# Altium schematic sheet ADC_8CH.SchDoc: =DocumentName
size A3; DocumentNumber: 1; Revision: 0; SheetNumber: 13; SheetTotal: 15; Last modified by: Krzysztof Belewicz
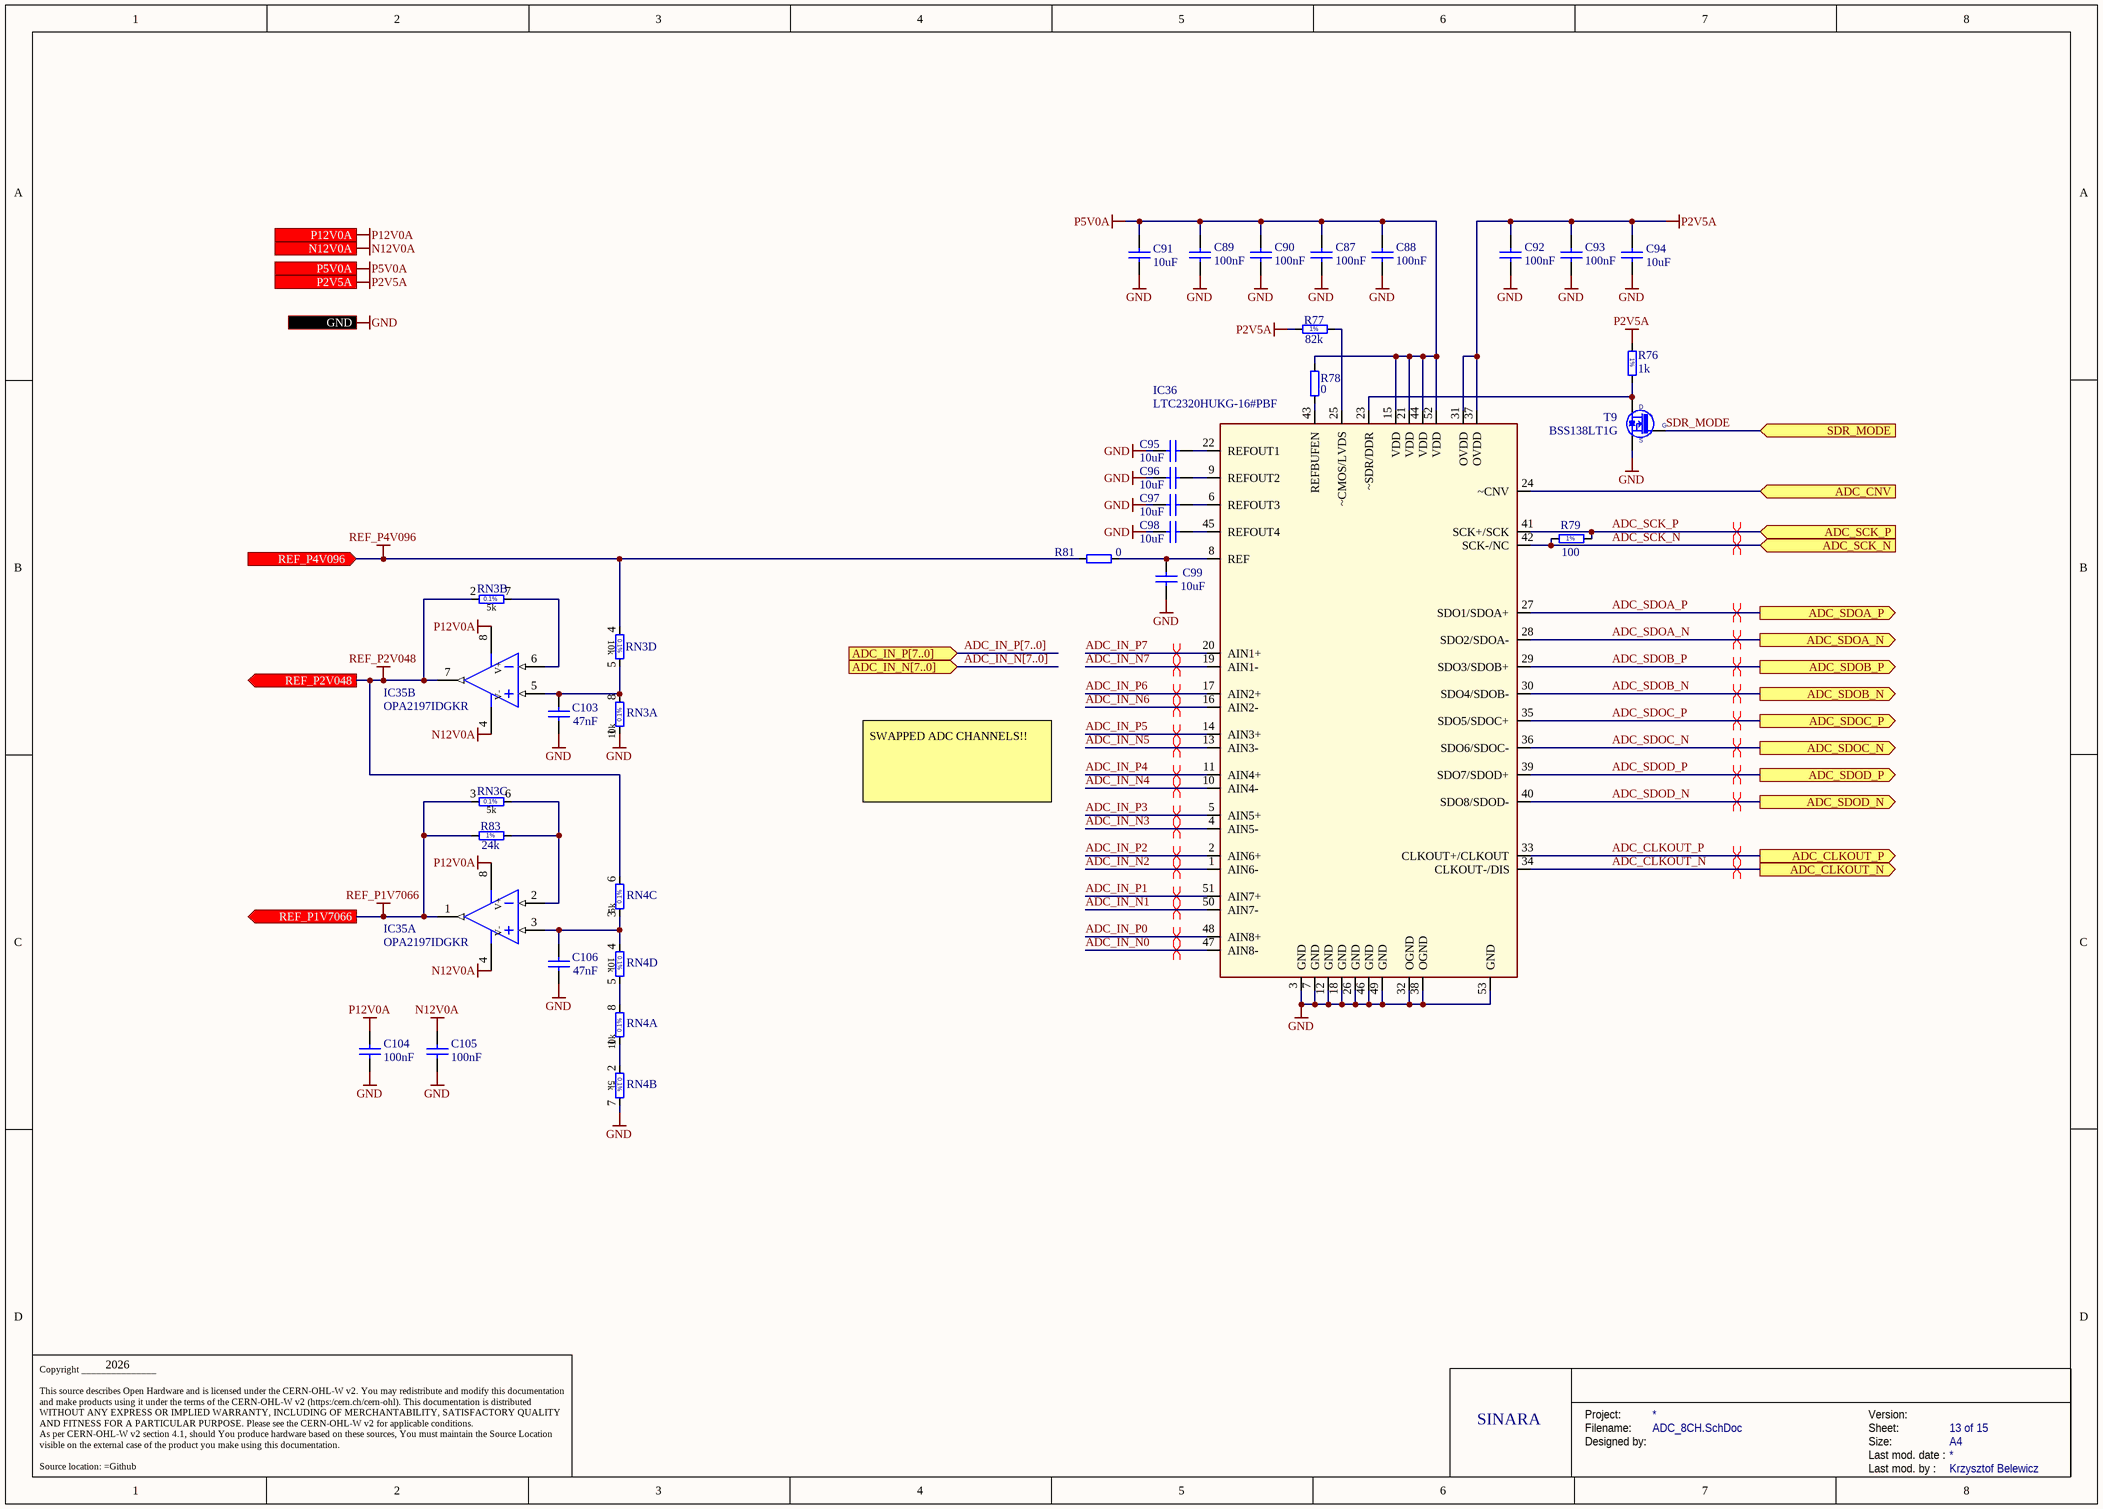
[diagram p0: ADC_8CH.SchDoc]

## Parts
C87  100nF  [CAPC1005X55N]
C88  100nF  [CAPC1005X55N]
C89  100nF  [CAPC1005X55N]
C90  100nF  [CAPC1005X55N]
C91  10uF  [CAPC2012X95N]
C92  100nF  [CAPC1005X55N]
C93  100nF  [CAPC1005X55N]
C94  10uF  [CAPC2012X95N]
C95  10uF  [CAPC2012X95N]
C96  10uF  [CAPC2012X95N]
C97  10uF  [CAPC2012X95N]
C98  10uF  [CAPC2012X95N]
C99  10uF  [CAPC2012X95N]
C103  47nF  [CAPC2012X135N]
C104  100nF  [CAPC1005X55N]
C105  100nF  [CAPC1005X55N]
C106  47nF  [CAPC2012X135N]
IC35  OPA2197IDGKR  [SOP65P490X110-8N]  (parts A,B of 2)
IC36  LTC2320HUKG-16#PBF  [QFN50P700X800X80_HS-53M]
R76  1k  [RESC1608X55N]
R77  82k  [RESC1608X55N]
R78  0  [RESC1005X40N]
R79  100  [RESC1005X40N]
R81  0  [RESC1005X40N]
R83  24k  [RESC1608X55N]
RN3  10k 5K 5K 10K  [SOIC127P600X175-8N]  (value not drawn)  (parts A,B,C,D of 4)
RN4  10k 5K 5K 10K  [SOIC127P600X175-8N]  (value not drawn)  (parts A,B,C,D of 4)
T9  BSS138LT1G  [SOT95P240X110-3N]

## Ports
ADC_CLKOUT_N (out), ADC_CLKOUT_P (out), ADC_CNV (in), ADC_IN_N[7..0] (in), ADC_IN_P[7..0] (in), ADC_SCK_N (in), ADC_SCK_P (in), ADC_SDOA_N (out), ADC_SDOA_P (out), ADC_SDOB_N (out), ADC_SDOB_P (out), ADC_SDOC_N (out), ADC_SDOC_P (out), ADC_SDOD_N (out), ADC_SDOD_P (out), GND, N12V0A (in), P2V5A (in), P5V0A (in), P12V0A (in), REF_P1V7066 (out), REF_P2V048 (out), REF_P4V096 (in), SDR_MODE (in)

## Nets
GND: C87.1 C88.1 C89.1 C90.1 C91.1 C92.1 C93.1 C94.1 C95.1 C96.1 C97.1 C98.1 C99.1 C103.1 C104.1 C105.1 C106.1 IC36.3(GND) IC36.7(GND) IC36.12(GND) IC36.18(GND) IC36.26(GND) IC36.32(OGND) IC36.38(OGND) IC36.46(GND) IC36.49(GND) IC36.53(GND) RN3.1 RN4.7 T9.2(S) ; port GND
N12V0A: C105.2 IC35.4(V-) ; port N12V0A
P2V5A: C92.2 C93.2 C94.2 IC36.31(OVDD) IC36.37(OVDD) R76.1 R77.1 ; port P2V5A
P5V0A: C87.2 C88.2 C89.2 C90.2 C91.2 IC36.15(VDD) IC36.21(VDD) IC36.44(VDD) IC36.52(VDD) R78.2 ; port P5V0A
P12V0A: C104.2 IC35.8(V+) ; port P12V0A
REF_P1V7066: IC35.1(OUT) R83.2 RN3.3 ; port REF_P1V7066
REF_P2V048: IC35.7(OUT) RN3.2 RN4.6 ; port REF_P2V048
REF_P4V096: R81.1 RN3.4 ; port REF_P4V096
ADC_CLKOUT_N: IC36.34(CLKOUT-/DIS) ; port ADC_CLKOUT_N
ADC_CLKOUT_P: IC36.33(CLKOUT+/CLKOUT) ; port ADC_CLKOUT_P
ADC_CNV: IC36.24(~CNV) ; port ADC_CNV
ADC_IN_N0: IC36.47(AIN8-)
ADC_IN_N1: IC36.50(AIN7-)
ADC_IN_N2: IC36.1(AIN6-)
ADC_IN_N3: IC36.4(AIN5-)
ADC_IN_N4: IC36.10(AIN4-)
ADC_IN_N5: IC36.13(AIN3-)
ADC_IN_N6: IC36.16(AIN2-)
ADC_IN_N7: IC36.19(AIN1-)
ADC_IN_P0: IC36.48(AIN8+)
ADC_IN_P1: IC36.51(AIN7+)
ADC_IN_P2: IC36.2(AIN6+)
ADC_IN_P3: IC36.5(AIN5+)
ADC_IN_P4: IC36.11(AIN4+)
ADC_IN_P5: IC36.14(AIN3+)
ADC_IN_P6: IC36.17(AIN2+)
ADC_IN_P7: IC36.20(AIN1+)
ADC_SCK_N: IC36.42(SCK-/NC) R79.1 ; port ADC_SCK_N
ADC_SCK_P: IC36.41(SCK+/SCK) R79.2 ; port ADC_SCK_P
ADC_SDOA_N: IC36.28(SDO2/SDOA-) ; port ADC_SDOA_N
ADC_SDOA_P: IC36.27(SDO1/SDOA+) ; port ADC_SDOA_P
ADC_SDOB_N: IC36.30(SDO4/SDOB-) ; port ADC_SDOB_N
ADC_SDOB_P: IC36.29(SDO3/SDOB+) ; port ADC_SDOB_P
ADC_SDOC_N: IC36.36(SDO6/SDOC-) ; port ADC_SDOC_N
ADC_SDOC_P: IC36.35(SDO5/SDOC+) ; port ADC_SDOC_P
ADC_SDOD_N: IC36.40(SDO8/SDOD-) ; port ADC_SDOD_N
ADC_SDOD_P: IC36.39(SDO7/SDOD+) ; port ADC_SDOD_P
SDR_MODE: T9.1(G) ; port SDR_MODE
NetC95_2: C95.2 IC36.22(REFOUT1)
NetC96_2: C96.2 IC36.9(REFOUT2)
NetC97_2: C97.2 IC36.6(REFOUT3)
NetC98_2: C98.2 IC36.45(REFOUT4)
NetC99_2: C99.2 IC36.8(REF) R81.2
NetC103_2: C103.2 IC35.5(IN+) RN3.5 RN3.8
NetC106_2: C106.2 IC35.3(IN+) RN4.3 RN4.4
NetIC35_2: IC35.2(IN-) R83.1 RN3.6
NetIC35_6: IC35.6(IN-) RN3.7
NetIC36_23: IC36.23(~SDR/DDR) R76.2 T9.3(D)
NetIC36_25: IC36.25(~CMOS/LVDS) R77.2
NetIC36_43: IC36.43(REFBUFEN) R78.1
NetRN4_1: RN4.1 RN4.2
NetRN4_5: RN4.5 RN4.8

## Buses and harness runs
bus ADC_IN_N[7..0] = port ADC_IN_N[7..0]
bus ADC_IN_P[7..0] = port ADC_IN_P[7..0]

## Layout directives
differential pair: ADC_CLKOUT_N, ADC_CLKOUT_P, ADC_IN_N0, ADC_IN_N1, ADC_IN_N2, ADC_IN_N3, ADC_IN_N4, ADC_IN_N5, ADC_IN_N6, ADC_IN_N7, ADC_IN_P0, ADC_IN_P1, ADC_IN_P2, ADC_IN_P3, ADC_IN_P4, ADC_IN_P5, ADC_IN_P6, ADC_IN_P7, ADC_SCK_N, ADC_SCK_P, ADC_SDOA_N, ADC_SDOA_P, ADC_SDOB_N, ADC_SDOB_P, ADC_SDOC_N, ADC_SDOC_P, ADC_SDOD_N, ADC_SDOD_P

## Notes on the sheet
- SWAPPED ADC CHANNELS!!
- 2026
- SINARA
- Project:
- Designed by:
- Filename:
- Size:
- Version:
- Last mod. date :
- Sheet:
- A4
- Copyright _______________
  This source describes Open Hardware and is licensed under the CERN-OHL-W v2. You may redistribute and modify this documentation and make products using it under the terms of the CERN-OHL-W v2 (https:/cern.ch/cern-ohl). This documentation is distributed WITHOUT ANY EXPRESS OR IMPLIED WARRANTY, INCLUDING OF MERCHANTABILITY, SATISFACTORY QUALITY AND FITNESS FOR A PARTICULAR PURPOSE. Please see the CERN-OHL-W v2 for applicable conditions.
  As per CERN-OHL-W v2 section 4.1, should You produce hardware based on these sources, You must maintain the Source Location visible on the external case of the product you make using this documentation.
  Source location: =Github
- Last mod. by :
- (in symbol R0402_100R_1%_0.1W_100PPM) 1%
- (in symbol R0603_1K_1%_0.1W_100PPM) 1%
- (in symbol R0603_24K_1%_0.1W_100PPM) 1%
- (in symbol R0603_82K_1%_0.1W_100PPM) 1%
- (in symbol RN_10K_5K_VISHAY_AORN2-1AT3, part A) 10k
- (in symbol RN_10K_5K_VISHAY_AORN2-1AT3, part B) 5k
- (in symbol RN_10K_5K_VISHAY_AORN2-1AT3, part C) 5k
- (in symbol RN_10K_5K_VISHAY_AORN2-1AT3, part D) 10k

## Library data of the parts
C87-C90 C92 C93 C104 C105 = CC0402_100NF_50V_10%_X7R: Non-polarised capacitor; Part Description: SMD Multilayer Chip Ceramic Capacitor; Manufacturer: GENERIC; Manufacturer1 Part Number: GRM155R71H104KE14D; Voltage: 50V; TC: X7R; Tolerance: ±10%; Part Number: CC0402_100NF_50V_10%_X7R; Component Kind: Standard; Component Type: Standard; Pin Count: 2; Value: 100nF; Status: None; Manufacturer Part Number: CC0402_100NF_50V_10%_X7R; Case: 0402; Mounted: Yes; Socket: No; SMD: Yes; Sense: No; Manufacturer1 Example: MURATA; Manufacturer1 ComponentHeight: 0.55mm; HelpURL: \\cern.ch\dfs\Applications\Altium\Datasheets\CC0402_MURATA_GRM155R71H104KE14D.pdf; Author: CERN DEM MR; CreateDate: 30.06.2017; LatestRevisionDate: 30.06.2017
C91 C94-C99 = CC0805_10UF_25V_10%_X5R: Non-polarised capacitor; Part Description: SMD Multilayer Chip Ceramic Capacitor; Manufacturer: GENERIC; Manufacturer1 Part Number: GRM219R61E106KA12D; Voltage: 25V; TC: X5R; Tolerance: ±10%; Part Number: CC0805_10UF_25V_10%_X5R; Component Kind: Standard; Component Type: Standard; Pin Count: 2; Value: 10uF; Status: Preferred; Manufacturer Part Number: CC0805_10UF_25V_10%_X5R; Case: 0805; Mounted: Yes; Socket: No; SMD: Yes; Sense: No; Manufacturer1 Example: MURATA; Manufacturer1 ComponentHeight: 0.95mm; HelpURL: \\cern.ch\dfs\Applications\Altium\Datasheets\CC0805_X5R_MURATA_GRM.pdf; Author: CERN DEM JLC; CreateDate: 25.10.2012; LatestRevisionDate: 06.09.2016
C103 C106 = CC0805_47NF_25V_5%_C0G: Non-polarised capacitor; Part Description: SMD Multilayer Chip Ceramic Capacitor; Manufacturer: GENERIC; Manufacturer1 Part Number: C0805C473J3GACTU; Voltage: 25V; TC: C0G/NP0; Tolerance: ±5%; Part Number: CC0805_47NF_25V_5%_C0G; Component Kind: Standard; Component Type: Standard; Pin Count: 2; Value: 47nF; Status: None; Manufacturer Part Number: CC0805_47NF_25V_5%_C0G; Case: 0805; Mounted: Yes; Socket: No; SMD: Yes; Sense: No; Manufacturer1 Example: KEMET; Manufacturer1 ComponentHeight: 1.4mm; HelpURL: \\cern.ch\dfs\Applications\Altium\Datasheets\CC0805_C0G_KEMET_(Commercial Grade).pdf; Author: CERN DEM JLC; CreateDate: 18.01.2011; LatestRevisionDate: 18.01.2011
IC35 = OA_OPA2197IDGKR: 36-V, Precision, Rail-to-Rail Input Output, Low Offset Voltage Op Amp 8-VSSOP; Part Description: High-Precision, Low-Noise, Rail-to-Rail Output,10-MHz Op Amp; Manufacturer: TEXAS INSTRUMENTS; PressFit: No; Bonding: No; Part Number: OPA2197IDGKR; Component Kind: Standard; Component Type: Standard; Device: OPA2197IDGKR; PackageDescription: SOP, 0.65mm pitch; 8 pin, 3.00mm W X 3.00mm L X 1.10mm H body, IPC Medium Density; Manufacturer Part Number: OPA2197IDGKR; Pin Count: 8; Case: MSOP8; Mounted: Yes; Socket: No; SMD: Yes; Sense: No; ComponentHeight: 1.1mm; Author: GK; HelpURL: \\cern.ch\dfs\Applications\Altium\Datasheets\OPA2140AIDGK.pdf; CreateDate: 20.04.2017; LatestRevisionDate: 20.04.2017
IC36 = ADC_LTC2320HUKG-16: Octal, 16-Bit, 1.5Msps/Ch  Simultaneous Sampling ADC; Manufacturer: LINEAR TECHNOLOGY; PressFit: No; Bonding: No; Part Number: LTC2320HUKG-16#PBF; Component Kind: Standard; Component Type: Standard; Device: LTC2320HUKG-16#PBF; PackageDescription: QFN, 52-Leads, Body 7.00x8.00mm, Pitch 0.50mm, Thermal Pad 5.41x6.40mm, IPC Low Density; Part Description: Octal, 16-Bit, 1.5Msps/Ch  Simultaneous Sampling ADC; Manufacturer Part Number: LTC2320HUKG-16#PBF; Pin Count: 48; Case: QFP48; Mounted: Yes; Socket: No; SMD: Yes; Sense: No; ComponentHeight: 0.8; Author: GK; HelpURL: \\cern.ch\dfs\Applications\Altium\Datasheets\LTC2335CLX-18#PBF.pdf; CreateDate: 10.01.2017; LatestRevisionDate: 10.01.2017
R76 = R0603_1K_1%_0.1W_100PPM: Resistor - 1%; Part Description: General Purpose Thick Film Chip Resistor; Manufacturer: GENERIC; Manufacturer1 Part Number: NRC06F1001TRF; Power: 0.1W; TC: ±100ppm/°C; Part Number: R0603_1K_1%_0.1W_100PPM; Component Kind: Standard; Component Type: Standard; Pin Count: 2; Value: 1k; Status: Preferred; Tolerance: ±1%; Manufacturer Part Number: R0603_1K_1%_0.1W_100PPM; Case: 0603; Mounted: Yes; Sense: No; Socket: No; SMD: Yes; Manufacturer1 Example: NIC COMPONENT; Manufacturer1 ComponentHeight: 0.55mm; HelpURL: \\cern.ch\dfs\Applications\Altium\Datasheets\R0603_NIC_NRC.pdf; Author: CERN DEM JLC; CreateDate: 03.12.2007; LatestRevisionDate: 13.03.2008
R77 = R0603_82K_1%_0.1W_100PPM: Resistor - 1%; Part Description: General Purpose Thick Film Chip Resistor; Manufacturer: GENERIC; Manufacturer1 Part Number: NRC06F8202TRF; Power: 0.1W; TC: ±100ppm/°C; Part Number: R0603_82K_1%_0.1W_100PPM; Component Kind: Standard; Component Type: Standard; Pin Count: 2; Value: 82k; Status: Preferred; Tolerance: ±1%; Manufacturer Part Number: R0603_82K_1%_0.1W_100PPM; Case: 0603; Mounted: Yes; Sense: No; Socket: No; SMD: Yes; Manufacturer1 Example: NIC COMPONENT; Manufacturer1 ComponentHeight: 0.55mm; HelpURL: \\cern.ch\dfs\Applications\Altium\Datasheets\R0603_NIC_NRC.pdf; Author: CERN DEM JLC; CreateDate: 03.12.2007; LatestRevisionDate: 13.03.2008
R78 R81 = R0402_0R_JUMPER: Resistor; Part Description: 1A (0.05R Max DC Resistance) Zero Ohm Jumper; Manufacturer: GENERIC; Manufacturer1 Part Number: 232270591001L; Part Number: R0402_0R_JUMPER; Component Kind: Standard; Component Type: Standard; Pin Count: 2; Value: 0; Status: Not recommended; Manufacturer Part Number: R0402_0R_JUMPER; Case: 0402; Mounted: Yes; Sense: No; Socket: No; SMD: Yes; Manufacturer1 Example: YAGEO PHYCOMP; Manufacturer1 ComponentHeight: 0.4mm; HelpURL: \\cern.ch\dfs\Applications\Altium\Datasheets\R0402_Phycomp_RC0402.pdf; Author: CERN DEM JLC; CreateDate: 03.12.2007; LatestRevisionDate: 17.10.2012
R79 = R0402_100R_1%_0.1W_100PPM: Resistor - 1%; Part Description: General Purpose Thick Film Chip Resistor; Manufacturer: GENERIC; Manufacturer Part Number: R0402_100R_1%_0.1W_100PPM_50V; Manufacturer1 Part Number: ERJ2RKF1000X; Power: 0.1W; TC: ±100ppm/°C; Voltage: 50V; Part Number: R0402_100R_1%_0.1W_100PPM; Component Kind: Standard; Component Type: Standard; Pin Count: 2; Value: 100; Status: Not recommended; Tolerance: ±1%; Case: 0402; Mounted: Yes; Sense: No; Socket: No; SMD: Yes; Manufacturer1 Example: PANASONIC; Manufacturer1 ComponentHeight: 0.4mm; HelpURL: \\cern.ch\dfs\Applications\Altium\Datasheets\R0402_PANASONIC_ERJ2RK.pdf; Author: CERN DEM JLC; CreateDate: 12.12.2013; LatestRevisionDate: 03.03.2015
R83 = R0603_24K_1%_0.1W_100PPM: Resistor - 1%; Part Description: General Purpose Thick Film Chip Resistor; Manufacturer: GENERIC; Manufacturer1 Part Number: NRC06F2402TRF; Power: 0.1W; TC: ±100ppm/°C; PressFit: No; Part Number: R0603_24K_1%_0.1W_100PPM; Component Kind: Standard; Component Type: Standard; Pin Count: 2; Value: 24k; Status: Preferred; Tolerance: ±1%; Manufacturer Part Number: R0603_24K_1%_0.1W_100PPM; Case: 0603; Mounted: Yes; Sense: No; Socket: No; SMD: Yes; Manufacturer1 Example: NIC COMPONENT; Manufacturer1 ComponentHeight: 0.55mm; HelpURL: \\cern.ch\dfs\Applications\Altium\Datasheets\R0603_NIC_NRC.pdf; Author: CERN DEM JLC; CreateDate: 03.12.2007; LatestRevisionDate: 13.03.2008
RN3 RN4 = RN_10K_5K_VISHAY_AORN2-1AT3: DIL8 Resistor Network 4 Resistors 10k-5k-5k-10k 0.1%; Part Description: Dual-In-Line Thin Film Precision Automotive Resistors Network, (4 Isolated) - AORN Series; Manufacturer: VISHAY DALE; Power: 4x0.1W; TC: ±25ppm/°C; PressFit: No; Part Number: RN_10K_5K_VISHAY_AORN2-1AT3; Component Kind: Standard; Component Type: Standard; Pin Count: 8; Value: 10k 5K 5K 10K; Sense: No; Tolerance: 0.1%; Manufacturer Part Number: AORN2-1AT3; Case: SOIC8; Mounted: Yes; Socket: No; SMD: Yes; ComponentHeight: 1.73mm; HelpURL: \\cern.ch\dfs\Applications\Altium\Datasheets\RN_VISHAY_AORN.pdf; Author: CERN DEM JLC; CreateDate: 20.02.2017; LatestRevisionDate: 20.02.2017
T9 = BSS138LT1G: N-CHANNEL MOSFET WITH DIODE; Part Description: 50V 200mA N-Channel Enhancement Mode Field-Effect Transistor; Manufacturer: ON SEMICONDUCTOR; PressFit: No; Bonding: No; Part Number: BSS138LT1G; Component Kind: Standard; Component Type: Standard; Device: BSS138LT1G; PackageDescription: SOT23 3-Leads, Pitch 0.95mm - Body 1.4x3mm, IPC Medium Density; Manufacturer Part Number: BSS138LT1G; Pin Count: 3; Case: SOT23-3; Mounted: Yes; Socket: No; SMD: Yes; Sense: No; ComponentHeight: 1.11mm; HelpURL: \\cern.ch\dfs\Applications\Altium\Datasheets\BSS138LT1G.pdf; Author: CERN DEM JLC; CreateDate: 23.03.2009; LatestRevisionDate: 23.03.2009